# EAGLE design Loadcell_board (EAGLE 9.6.2)
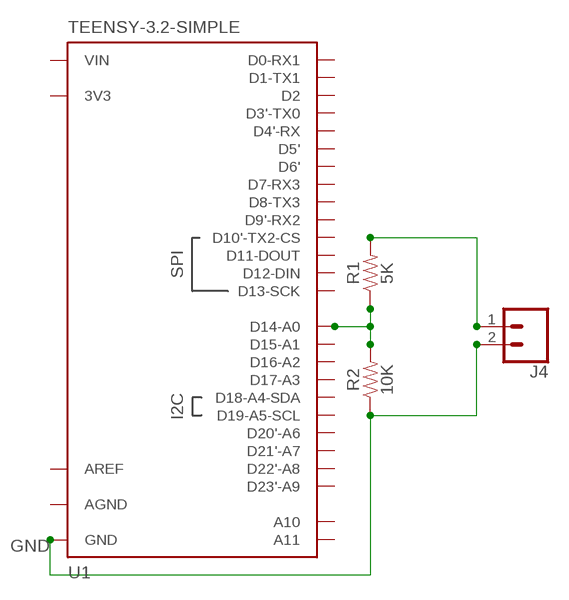
[diagram p0: schematic, sheet 1]

## Parts
J4  CONN_02  [1X02]
R1  5K  1KOHM-HORIZ-1/4W-5%  [AXIAL-0.3]
R2  10K  1KOHM-HORIZ-1/4W-5%  [AXIAL-0.3]
U1  TEENSY-3.2-SIMPLE  [TEENSY-3.2-SIMPLE]

## Nets
GND: J4.2 R2.P$1 U1.GND
N$1: R1.P$1 R2.P$2 U1.14(D14-A0)
N$5: J4.1 R1.P$2
Unconnected: U1.0(D0-RX1) U1.1(D1-TX1) U1.2(D2) U1.3(D3'-TX0) U1.4(D4'-RX) U1.5(D5') U1.6(D6') U1.7(D7-RX3) U1.8(D8-TX3) U1.9(D9'-RX2) U1.10(D10'-TX2-CS) U1.11(D11-DOUT) U1.12(D12-DIN) U1.13(D13-SCK) U1.15(D15-A1) U1.16(D16-A2) U1.17(D17-A3) U1.18(D18-A4-SDA) U1.19(D19-A5-SCL) U1.20(D20'-A6) U1.21(D21'-A7) U1.22(D22'-A8) U1.23(D23'-A9) U1.A10 U1.A11

## Power pins joined to a net without a drawn wire
3V3: U1.3.3V(3V3)
AGND: U1.AGND
AREF: U1.AREF
VIN: U1.VIN

## Library data of the parts
J4 = SparkFun-Connectors:CONN_02: Multi connection point. Often used as Generic Header-pin footprint for 0.1 inch spaced/style header connections On any of the 0.1 inch spaced packages, you can populate with these: Break Away Headers - Straight <https://www.sparkfun.com/products/116> (PRT-00116) Break Away Male Headers - Right Angle <https://www.sparkfun.com/products/553> (PRT-00553) Female Headers <https://www.sparkfun.com/products/115> (PRT-00115) Break Away Headers - Machine Pin <https://www.sparkfun.com/products/117> (PRT-00117) Break Away Female Headers - Swiss Machine Pin <https://www.sparkfun.com/products/743> (PRT-00743) For SCREWTERMINALS and SPRING TERMINALS visit here: Screw Terimnals on SparkFun.com <https://www.sparkfun.com/search/results?term=Screw+Terminals> (5mm/3.5mm/2.54mm spacing) This device is also useful as a general connection point to wire up your design to another part of your project. Our various solder wires solder well into these plated through hole pads. Hook-Up Wire - Assortment (Stranded, 22 AWG) <https://www.sparkfun.com/products/11375> (PRT-11375) Hook-Up Wire - Assortment (Solid Core, 22 AWG) <https://www.sparkfun.com/products/11367> (PRT-11367) View the entire wire category on our website here <https://www.sparkfun.com/categories/141> Special notes: Molex polarized connector foot print use with: PRT-08233 with associated crimp pins and housings. 2.54_SCREWTERM for use with PRT-10571. 3.5mm Screw Terminal footprints for PRT-08084 5mm Screw Terminal footprints for use with PRT-08432
R1 R2 = SparkFun-Resistors:1KOHM: 1kΩ resistor A resistor is a passive two-terminal electrical component that implements electrical resistance as a circuit element. Resistors act to reduce current flow, and, at the same time, act to lower voltage levels within circuits. - Wikipedia; PROD_ID: RES-08380; VALUE: 1k
U1 = nordin-pga and filter:TEENSY-3.2-SIMPLE

## Board
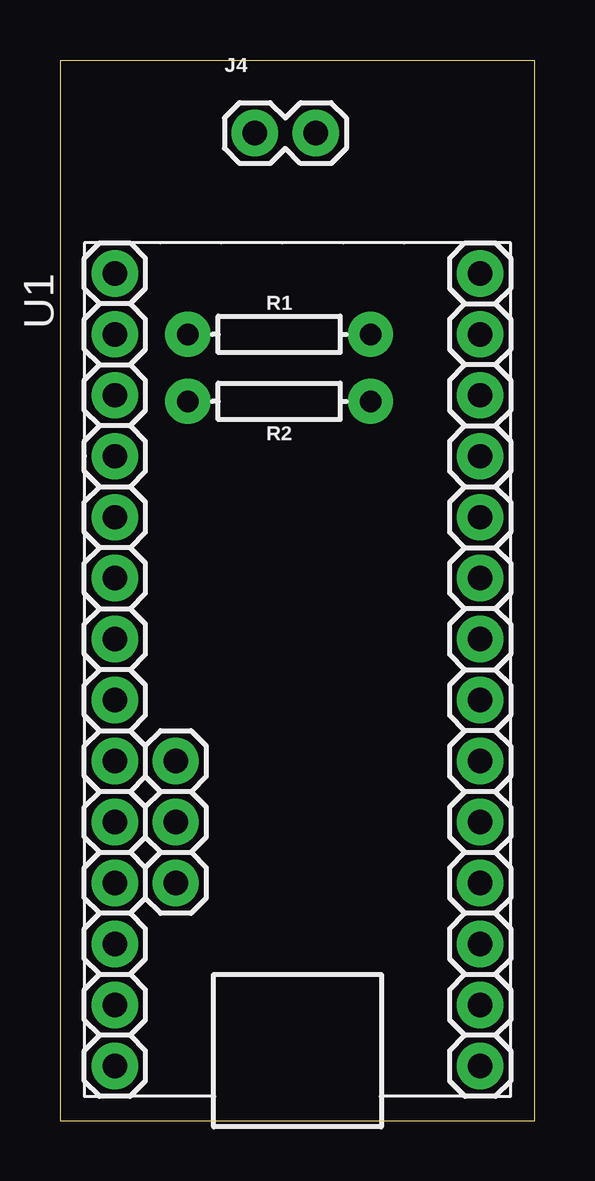
[diagram p1: board, top side]
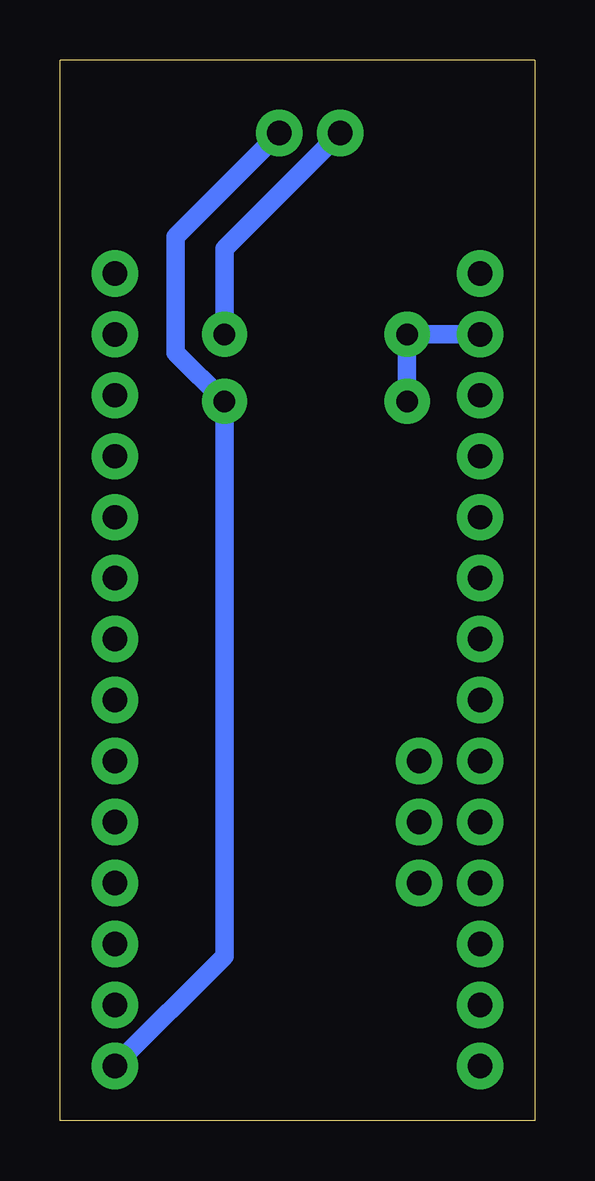
[diagram p2: board, bottom side, seen from below]

Size 19.81 x 44.2 mm. Coordinates in mm from the lower left corner, seen from the top.
Outline: 0,0 19.81,0 19.81,44.2 0,44.2 0,0
Copper layers (1*16): Top 0.035mm / dielectric 1.5mm / Bottom 0.035mm
Design rules "elcdrc2": minimum track width 18mil, minimum drill 1mm, track to track 12mil, track to pad 12mil, pad to pad 12mil, via to via 12mil, smd to smd 6mil, copper to edge 12mil, drill to drill 12mil, minimum pad ring 18mil, minimum via ring 18mil, stop-mask expansion 4mil, vias tented up to drill 0mil, thermal gap 10mil

### Footprints (pad centres in the part's own frame; a part is rotated, then mirrored left to right if it is on the bottom)
1X02 = drill 1.016 pad 1.88: 1 0,0; 2 2.54,0
AXIAL-0.3 = drill 0.9 pad 1.88: P$1 -3.81,0; P$2 3.81,0
TEENSY-3.2-SIMPLE = drill 1.016 pad 1.778: 0 -7.62,13.97; 1 -7.62,11.43; 2 -7.62,8.89; 3 -7.62,6.35; 3.3V 7.62,11.43; 4 -7.62,3.81; 5 -7.62,1.27; 6 -7.62,-1.27; 7 -7.62,-3.81; 8 -7.62,-6.35; 9 -7.62,-8.89; 10 -7.62,-11.43; 11 -7.62,-13.97; 12 -7.62,-16.51; 13 7.62,-16.51; 14 7.62,-13.97; 15 7.62,-11.43; 16 7.62,-8.89; 17 7.62,-6.35; 18 7.62,-3.81; 19 7.62,-1.27; 20 7.62,1.27; 21 7.62,3.81; 22 7.62,6.35; 23 7.62,8.89; A10 5.08,6.35; A11 5.08,3.81; AGND 7.62,13.97; AREF 5.08,8.89; GND -7.62,16.51; VIN 7.62,16.51

### Placement (x,y rotation side)
J4  8.13,41.15 0 top
R1  9.14,32.77 0 top
R2  9.14,29.97 180 top
U1  9.91,18.8 180 top

### Tracks (layer width: path | path; a pad name or v marks a point on that pad's centre or on a via)
GND
  Bottom 0.762: U1.GND 12.95,6.86 R2.P$1 14.99,32 14.99,36.83 J4.2
N$1
  Bottom 0.762: U1.14 R1.P$1 R2.P$2
N$5
  Bottom 0.762: R1.P$2 12.95,36.32 J4.1